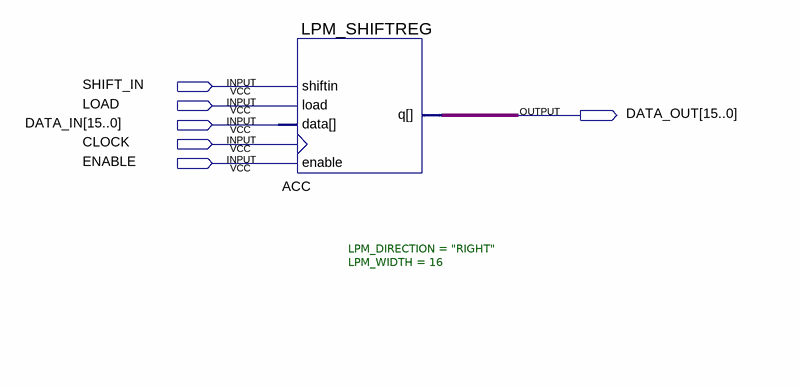
[diagram p0: schematic sheet]
// Quartus schematic SHIFTREG_TEST_BDF.bdf as structural Verilog: 1 symbols, 6 pins
module SHIFTREG_TEST_BDF (
  input  SHIFT_IN,
  input  LOAD,
  input  [15:0] DATA_IN,
  input  CLOCK,
  input  ENABLE,
  output [15:0] DATA_OUT
);

  LPM_SHIFTREG #(.LPM_DIRECTION("RIGHT"), .LPM_WIDTH(16)) ACC (
    .clock(CLOCK), .data(DATA_IN), .enable(ENABLE), .load(LOAD), .shiftin(SHIFT_IN), .q(DATA_OUT));
endmodule
